# Altium project PVS332V0MAINBOARD.PRJPCB
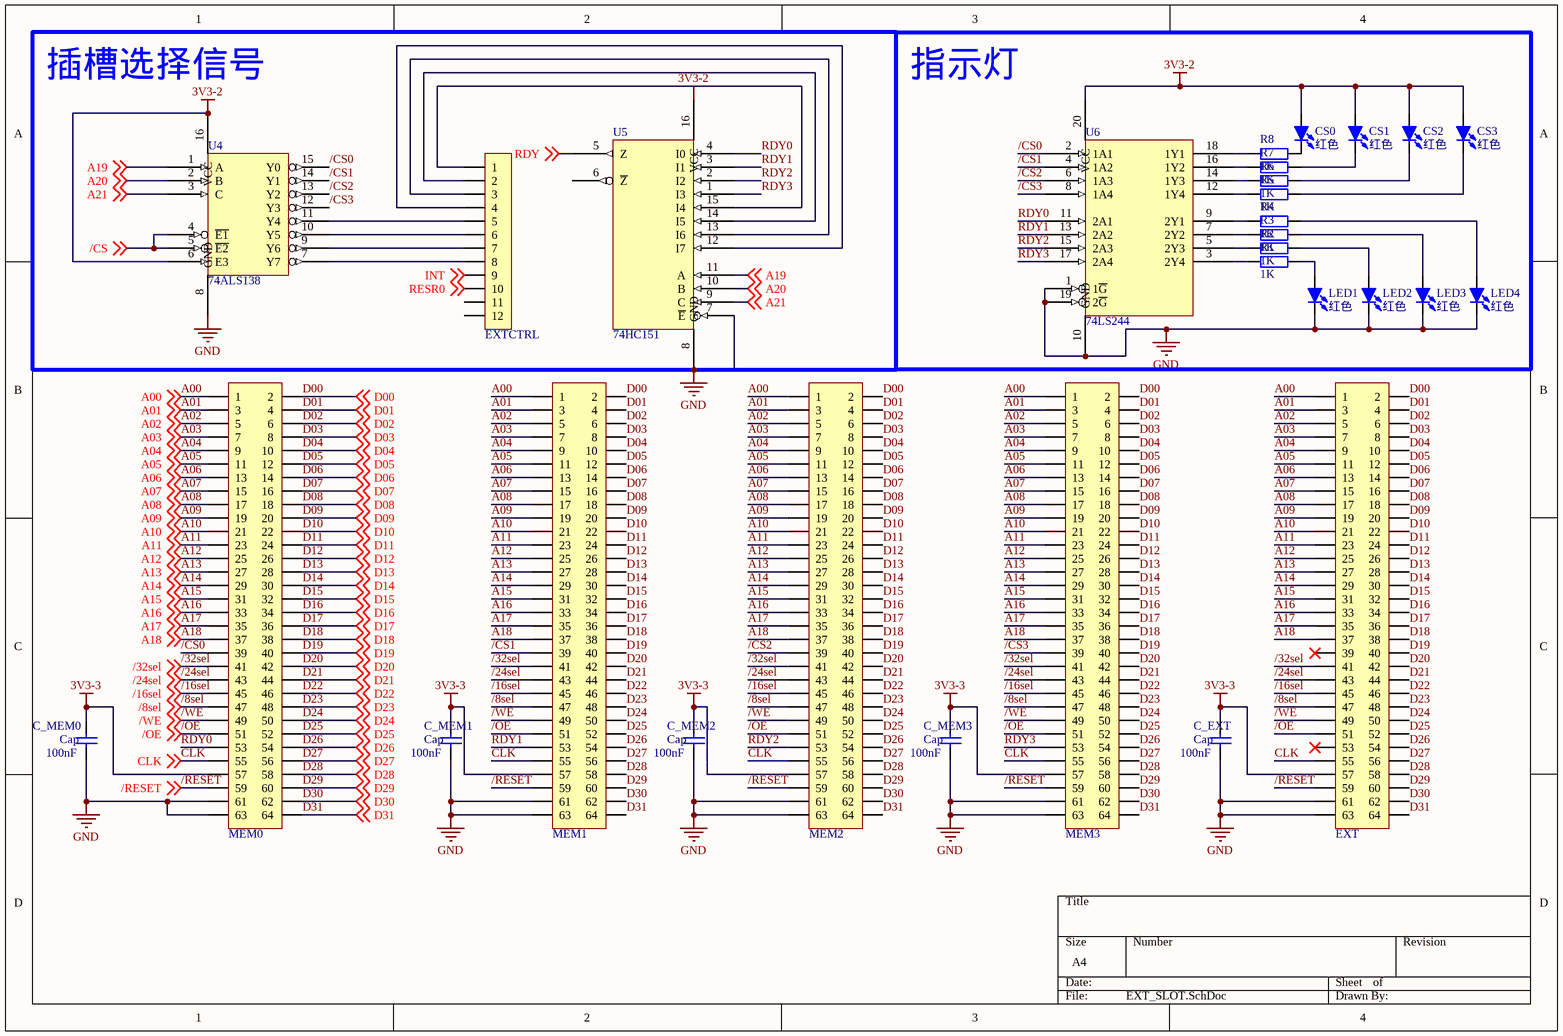
[diagram p0: EXT_SLOT.SchDoc]
3 sheets, 94 parts. Net scope: global (net labels, ports and power ports of the same name join across sheets).
Board file: PCB1.PcbDoc
Sheets:
  EXT_SLOT.SchDoc
  CPU&POWER.SchDoc
  SPI_IO.SchDoc

## Sheet EXT_SLOT.SchDoc
size A4

### Parts
C_EXT  Cap  value 100nF  [0805]
C_MEM0  Cap  value 100nF  [0805]
C_MEM1  Cap  value 100nF  [0805]
C_MEM2  Cap  value 100nF  [0805]
C_MEM3  Cap  value 100nF  [0805]
CS0  红色  [LED 5MM-B]
CS1  红色  [LED 5MM-B]
CS2  红色  [LED 5MM-B]
CS3  红色  [LED 5MM-B]
EXT  Header 2X32  [IDC2.54-V64D]  (value not drawn)
EXTCTRL  HDR-1X12  [SIP12]  (value not drawn)
LED1  红色  [LED 5MM-B]
LED2  红色  [LED 5MM-B]
LED3  红色  [LED 5MM-B]
LED4  红色  [LED 5MM-B]
MEM0  Header 2X32  [IDC2.54-V64D]  (value not drawn)
MEM1  Header 2X32  [IDC2.54-V64D]  (value not drawn)
MEM2  Header 2X32  [IDC2.54-V64D]  (value not drawn)
MEM3  Header 2X32  [IDC2.54-V64D]  (value not drawn)
R1  1K  [0805]
R2  1K  [0805]
R3  1K  [0805]
R4  1K  [0805]
R5  1K  [0805]
R6  1K  [0805]
R7  1K  [0805]
R8  1K  [0805]
U4  74ALS138  [SO-16]
U5  74HC151  [SO-16]
U6  74LS244  [SOJ-20]

### Blocks framed on the sheet
插槽选择信号: EXTCTRL U4 U5

### Nets
3V3-2: CS0.1(A) CS1.1(A) CS2.1(A) CS3.1(A) U4.6(E3) U4.16(VCC) U5.16(VCC) U6.20(VCC)  [also labelled VCC]  [project net 3V3-1]
3V3-3: C_EXT.2 C_MEM0.2 C_MEM1.2 C_MEM2.2 C_MEM3.2 EXT.57 MEM0.57 MEM1.57 MEM2.57 MEM3.57
GND: C_EXT.1 C_MEM0.1 C_MEM1.1 C_MEM2.1 C_MEM3.1 EXT.61 EXT.63 LED1.2(K) LED2.2(K) LED3.2(K) LED4.2(K) MEM0.61 MEM0.63 MEM1.61 MEM1.63 MEM2.61 MEM2.63 MEM3.61 MEM3.63 U4.8(GND) U5.7(~{E}) U5.8(GND) U6.1(1~{G}) U6.10(GND) U6.19(2~{G})
/8sel: EXT.47 MEM0.47 MEM1.47 MEM2.47 MEM3.47 ; off-sheet /8sel
/16sel: EXT.45 MEM0.45 MEM1.45 MEM2.45 MEM3.45 ; off-sheet /16sel
/24sel: EXT.43 MEM0.43 MEM1.43 MEM2.43 MEM3.43 ; off-sheet /24sel
/32sel: EXT.41 MEM0.41 MEM1.41 MEM2.41 MEM3.41 ; off-sheet /32sel
/CS: U4.4(~{E1}) U4.5(~{E2}) ; off-sheet /CS
/CS0: MEM0.39 U4.15(Y0) U6.2(1A1)
/CS1: MEM1.39 U4.14(Y1) U6.4(1A2)
/CS2: MEM2.39 U4.13(Y2) U6.6(1A3)
/CS3: MEM3.39 U4.12(Y3) U6.8(1A4)
/OE: EXT.51 MEM0.51 MEM1.51 MEM2.51 MEM3.51 ; off-sheet /OE
/RESET: EXT.59 MEM0.59 MEM1.59 MEM2.59 MEM3.59 ; off-sheet /RESET
/WE: EXT.49 MEM0.49 MEM1.49 MEM2.49 MEM3.49 ; off-sheet /WE
A00: EXT.1 MEM0.1 MEM1.1 MEM2.1 MEM3.1 ; off-sheet A00
A01: EXT.3 MEM0.3 MEM1.3 MEM2.3 MEM3.3 ; off-sheet A01
A02: EXT.5 MEM0.5 MEM1.5 MEM2.5 MEM3.5 ; off-sheet A02
A03: EXT.7 MEM0.7 MEM1.7 MEM2.7 MEM3.7 ; off-sheet A03
A04: EXT.9 MEM0.9 MEM1.9 MEM2.9 MEM3.9 ; off-sheet A04
A05: EXT.11 MEM0.11 MEM1.11 MEM2.11 MEM3.11 ; off-sheet A05
A06: EXT.13 MEM0.13 MEM1.13 MEM2.13 MEM3.13 ; off-sheet A06
A07: EXT.15 MEM0.15 MEM1.15 MEM2.15 MEM3.15 ; off-sheet A07
A08: EXT.17 MEM0.17 MEM1.17 MEM2.17 MEM3.17 ; off-sheet A08
A09: EXT.19 MEM0.19 MEM1.19 MEM2.19 MEM3.19 ; off-sheet A09
A10: EXT.21 MEM0.21 MEM1.21 MEM2.21 MEM3.21 ; off-sheet A10
A11: EXT.23 MEM0.23 MEM1.23 MEM2.23 MEM3.23 ; off-sheet A11
A12: EXT.25 MEM0.25 MEM1.25 MEM2.25 MEM3.25 ; off-sheet A12
A13: EXT.27 MEM0.27 MEM1.27 MEM2.27 MEM3.27 ; off-sheet A13
A14: EXT.29 MEM0.29 MEM1.29 MEM2.29 MEM3.29 ; off-sheet A14
A15: EXT.31 MEM0.31 MEM1.31 MEM2.31 MEM3.31 ; off-sheet A15
A16: EXT.33 MEM0.33 MEM1.33 MEM2.33 MEM3.33 ; off-sheet A16
A17: EXT.35 MEM0.35 MEM1.35 MEM2.35 MEM3.35 ; off-sheet A17
A18: EXT.37 MEM0.37 MEM1.37 MEM2.37 MEM3.37 ; off-sheet A18
A19: U4.1(A) U5.11(A) ; off-sheet A19
A20: U4.2(B) U5.10(B) ; off-sheet A20
A21: U4.3(C) U5.9(C) ; off-sheet A21
CLK: EXT.55 MEM0.55 MEM1.55 MEM2.55 MEM3.55 ; off-sheet CLK
D00: EXT.2 MEM0.2 MEM1.2 MEM2.2 MEM3.2 ; off-sheet D00
D01: EXT.4 MEM0.4 MEM1.4 MEM2.4 MEM3.4 ; off-sheet D01
D02: EXT.6 MEM0.6 MEM1.6 MEM2.6 MEM3.6 ; off-sheet D02
D03: EXT.8 MEM0.8 MEM1.8 MEM2.8 MEM3.8 ; off-sheet D03
D04: EXT.10 MEM0.10 MEM1.10 MEM2.10 MEM3.10 ; off-sheet D04
D05: EXT.12 MEM0.12 MEM1.12 MEM2.12 MEM3.12 ; off-sheet D05
D06: EXT.14 MEM0.14 MEM1.14 MEM2.14 MEM3.14 ; off-sheet D06
D07: EXT.16 MEM0.16 MEM1.16 MEM2.16 MEM3.16 ; off-sheet D07
D08: EXT.18 MEM0.18 MEM1.18 MEM2.18 MEM3.18 ; off-sheet D08
D09: EXT.20 MEM0.20 MEM1.20 MEM2.20 MEM3.20 ; off-sheet D09
D10: EXT.22 MEM0.22 MEM1.22 MEM2.22 MEM3.22 ; off-sheet D10
D11: EXT.24 MEM0.24 MEM1.24 MEM2.24 MEM3.24 ; off-sheet D11
D12: EXT.26 MEM0.26 MEM1.26 MEM2.26 MEM3.26 ; off-sheet D12
D13: EXT.28 MEM0.28 MEM1.28 MEM2.28 MEM3.28 ; off-sheet D13
D14: EXT.30 MEM0.30 MEM1.30 MEM2.30 MEM3.30 ; off-sheet D14
D15: EXT.32 MEM0.32 MEM1.32 MEM2.32 MEM3.32 ; off-sheet D15
D16: EXT.34 MEM0.34 MEM1.34 MEM2.34 MEM3.34 ; off-sheet D16
D17: EXT.36 MEM0.36 MEM1.36 MEM2.36 MEM3.36 ; off-sheet D17
D18: EXT.38 MEM0.38 MEM1.38 MEM2.38 MEM3.38 ; off-sheet D18
D19: EXT.40 MEM0.40 MEM1.40 MEM2.40 MEM3.40 ; off-sheet D19
D20: EXT.42 MEM0.42 MEM1.42 MEM2.42 MEM3.42 ; off-sheet D20
D21: EXT.44 MEM0.44 MEM1.44 MEM2.44 MEM3.44 ; off-sheet D21
D22: EXT.46 MEM0.46 MEM1.46 MEM2.46 MEM3.46 ; off-sheet D22
D23: EXT.48 MEM0.48 MEM1.48 MEM2.48 MEM3.48 ; off-sheet D23
D24: EXT.50 MEM0.50 MEM1.50 MEM2.50 MEM3.50 ; off-sheet D24
D25: EXT.52 MEM0.52 MEM1.52 MEM2.52 MEM3.52 ; off-sheet D25
D26: EXT.54 MEM0.54 MEM1.54 MEM2.54 MEM3.54 ; off-sheet D26
D27: EXT.56 MEM0.56 MEM1.56 MEM2.56 MEM3.56 ; off-sheet D27
D28: EXT.58 MEM0.58 MEM1.58 MEM2.58 MEM3.58 ; off-sheet D28
D29: EXT.60 MEM0.60 MEM1.60 MEM2.60 MEM3.60 ; off-sheet D29
D30: EXT.62 MEM0.62 MEM1.62 MEM2.62 MEM3.62 ; off-sheet D30
D31: EXT.64 MEM0.64 MEM1.64 MEM2.64 MEM3.64 ; off-sheet D31
INT: EXTCTRL.9 ; off-sheet INT
RDY: U5.5(Z) ; off-sheet RDY
RDY0: MEM0.53 U5.4(I0) U6.11(2A1)
RDY1: MEM1.53 U5.3(I1) U6.13(2A2)
RDY2: MEM2.53 U5.2(I2) U6.15(2A3)
RDY3: MEM3.53 U5.1(I3) U6.17(2A4)
RESR0: EXTCTRL.10 ; off-sheet RESR0
NetCS0_2: CS0.2(K) R8.2
NetCS1_2: CS1.2(K) R7.2
NetCS2_2: CS2.2(K) R6.2
NetCS3_2: CS3.2(K) R5.2
NetEXTCTRL_1: EXTCTRL.1 U5.15(I4)
NetEXTCTRL_2: EXTCTRL.2 U5.14(I5)
NetEXTCTRL_3: EXTCTRL.3 U5.13(I6)
NetEXTCTRL_4: EXTCTRL.4 U5.12(I7)
NetEXTCTRL_5: EXTCTRL.5 U4.11(Y4)
NetEXTCTRL_6: EXTCTRL.6 U4.10(Y5)
NetEXTCTRL_7: EXTCTRL.7 U4.9(Y6)
NetEXTCTRL_8: EXTCTRL.8 U4.7(Y7)
NetLED1_1: LED1.1(A) R1.2
NetLED2_1: LED2.1(A) R2.2
NetLED3_1: LED3.1(A) R3.2
NetLED4_1: LED4.1(A) R4.2
NetR1_1: R1.1 U6.3(2Y4)
NetR2_1: R2.1 U6.5(2Y3)
NetR3_1: R3.1 U6.7(2Y2)
NetR4_1: R4.1 U6.9(2Y1)
NetR5_1: R5.1 U6.12(1Y4)
NetR6_1: R6.1 U6.14(1Y3)
NetR7_1: R7.1 U6.16(1Y2)
NetR8_1: R8.1 U6.18(1Y1)

Not connected (* = marked no-connect by the designer): EXT 39* 53*; EXTCTRL 11 12; U5 6(~{Z})

### Notes on the sheet
- 指示灯

### Library data of the parts
C_EXT C_MEM0-C_MEM3 = Cap: Capacitor; Published: 8-Jun-2000; LatestRevisionDate: 17-Jul-2002; LatestRevisionNote: Re-released for DXP Platform.; PackageReference: RAD-0.3; Publisher: Altium Limited; PackageDescription: Radial Cap, Thru-Hole; 2 Leads; 0.3 in Pin Spacing
CS0-CS3 LED1-LED4 = LED-5MM: 5mm插件LED; 版权归属: 源创客; BOM名称: 5mm插件LED; 学习资源: www.ooocke.com
EXT MEM0-MEM3 = Header 32X2: 32*2P接插件; BOM名称: 20*2P接插件; 版权归属: 源创客; 学习资源: www.ooocke.com
EXTCTRL = Header 12: 12P接插件; 版权归属: 源创客; BOM名称: 12P接插件; 学习资源: www.ooocke.com
R1-R8 = R: 贴片电阻; 版权归属: 源创客; BOM名称: 贴片电阻; 学习资源: www.ooocke.com

## Sheet CPU&POWER.SchDoc
size A4
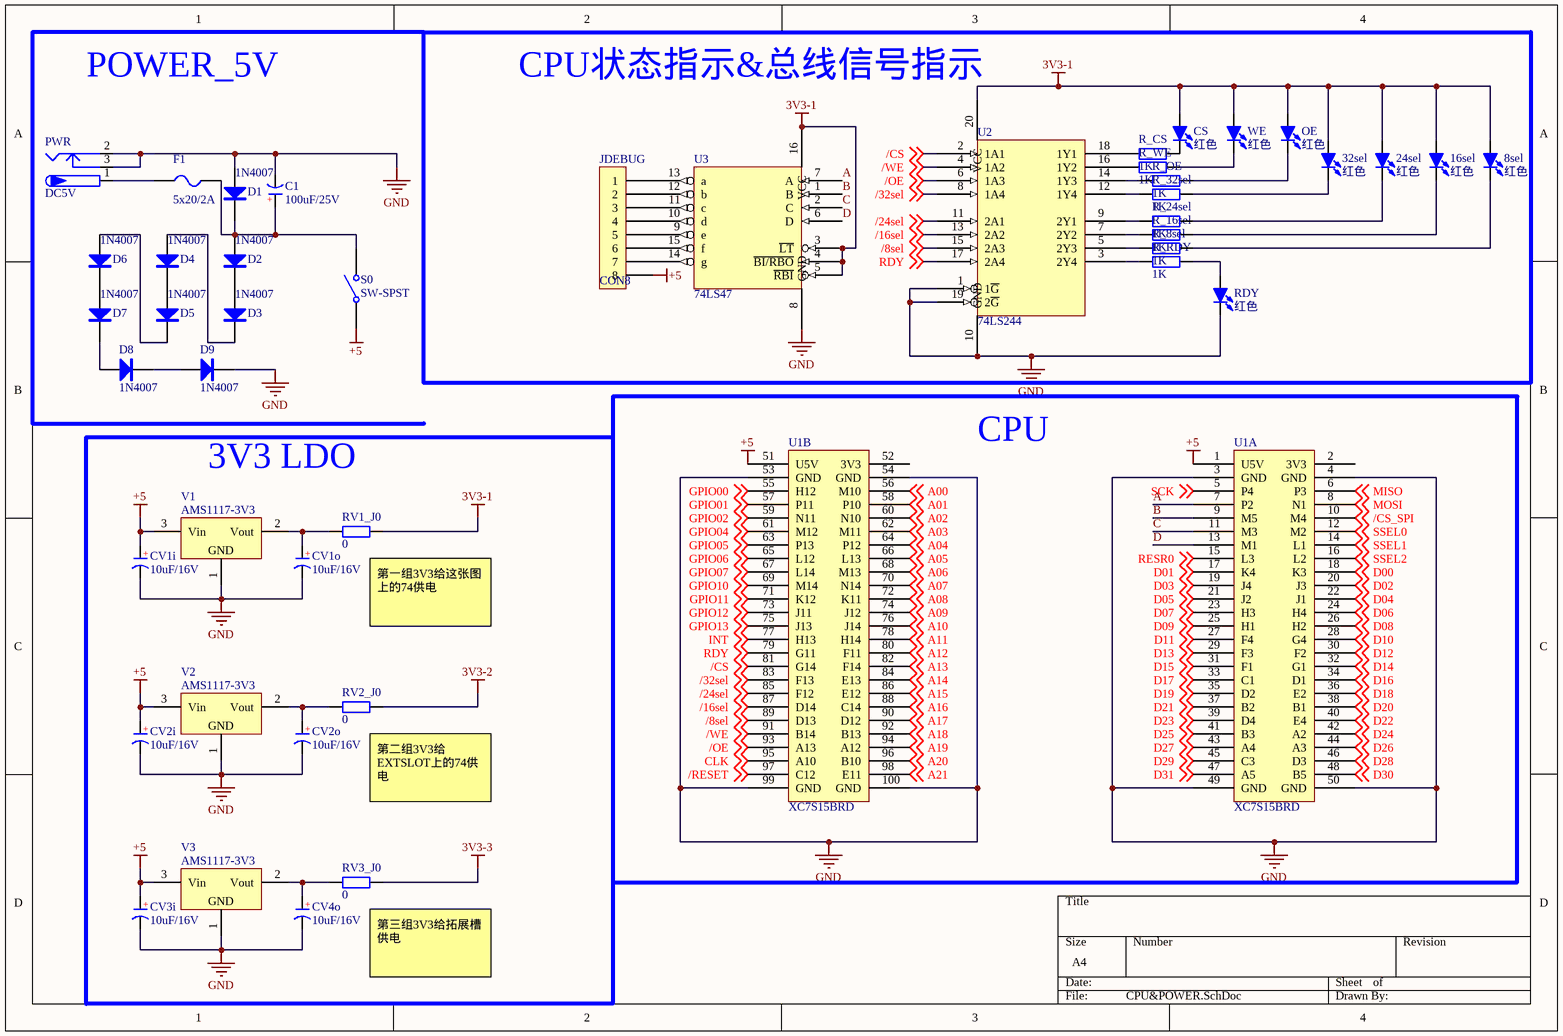
[diagram p1: CPU&POWER.SchDoc]

### Parts
8sel  红色  [LED 5MM-Y]
16sel  红色  [LED 5MM-YC]
24sel  红色  [LED 5MM-YC]
32sel  红色  [LED 5MM-YC]
C1  100uF/25V  [CAP3.0]
CS  红色  [LED 5MM-B]
CV1i  10uF/16V  [CAP2.54M]
CV1o  10uF/16V  [CAP2.54M]
CV2i  10uF/16V  [CAP2.54M]
CV2o  10uF/16V  [CAP2.54M]
CV3i  10uF/16V  [CAP2.54M]
CV4o  10uF/16V  [CAP2.54M]
D1  1N4007  [DO-41]
D2  1N4007  [DO-41]
D3  1N4007  [DO-41]
D4  1N4007  [DO-41]
D5  1N4007  [DO-41]
D6  1N4007  [DO-41]
D7  1N4007  [DO-41]
D8  1N4007  [DO-41]
D9  1N4007  [DO-41]
F1  5x20/2A  [FU 5x20]
JDEBUG  CON8  [SIP8]
OE  红色  [LED 5MM-B]
PWR  DC5V  [DC-005]
R_8sel  1K  [0805]
R_16sel  1K  [0805]
R_24sel  1K  [0805]
R_32sel  1K  [0805]
R_CS  1K  [0805]
R_OE  1K  [0805]
R_RDY  1K  [0805]
R_WE  1K  [0805]
RDY  红色  [LED 5MM-B]
RV1_J0  0  [0805]
RV2_J0  0  [0805]
RV3_J0  0  [0805]
S0  SW-SPST  [DIP6]
U1  XC7S15BRD  [XC7S15BRD]  (parts A,B of 2)
U2  74LS244  [SOJ-20]
U3  74LS47  [DIP-16]
V1  AMS1117-3V3  [SOT-223_手工焊接]
V2  AMS1117-3V3  [SOT-223_手工焊接]
V3  AMS1117-3V3  [SOT-223_手工焊接]
WE  红色  [LED 5MM-B]

### Blocks framed on the sheet
CPU状态指示&总线信号指示: 8sel 16sel 24sel 32sel CS JDEBUG OE R_8sel R_16sel R_24sel R_32sel R_CS R_OE R_RDY R_WE RDY U2 U3 WE
CPU: U1
3V3 LDO: CV1i CV1o CV2i CV2o CV3i CV4o RV1_J0 RV2_J0 RV3_J0 V1-V3

### Nets
3V3-1: 8sel.1(A) 16sel.1(A) 24sel.1(A) 32sel.1(A) CS.1(A) OE.1(A) RV1_J0.2 RV2_J0.2 U2.20(VCC) U3.3(~{LT}) U3.4(~{BI/RBO}) U3.5(~{RBI}) U3.16(VCC) WE.1(A)  [also labelled 3V3-2, VCC]
3V3-3: RV3_J0.2
+5: CV1i.1(A) CV2i.1(A) CV3i.1(A) JDEBUG.8 S0.1(COMMON) U1.1(U5V) U1.51(U5V) V1.3(Vin) V2.3(Vin) V3.3(Vin)
GND: C1.2(K) CV1i.2(K) CV1o.2(K) CV2i.2(K) CV2o.2(K) CV3i.2(K) CV4o.2(K) D1.1(A) D9.2(K) PWR.2 PWR.3 RDY.2(K) U1.3(GND) U1.4(GND) U1.49(GND) U1.50(GND) U1.53(GND) U1.54(GND) U1.99(GND) U1.100(GND) U2.1(1~{G}) U2.10(GND) U2.19(2~{G}) U3.8(GND) V1.1(GND) V2.1(GND) V3.1(GND)
/8sel: U1.89(D13) U2.15(2A3) ; off-sheet /8sel
/16sel: U1.87(D14) U2.13(2A2) ; off-sheet /16sel
/24sel: U1.85(F12) U2.11(2A1) ; off-sheet /24sel
/32sel: U1.83(F13) U2.8(1A4) ; off-sheet /32sel
/CS: U1.81(G14) U2.2(1A1) ; off-sheet /CS
/CS_SPI: U1.10(M4) ; off-sheet /CS_SPI
/OE: U1.93(A13) U2.6(1A3) ; off-sheet /OE
/RESET: U1.97(C12) ; off-sheet /RESET
/WE: U1.91(B14) U2.4(1A2) ; off-sheet /WE
A: U1.7(P2) U3.7(A)
A00: U1.56(M10) ; off-sheet A00
A01: U1.58(P10) ; off-sheet A01
A02: U1.60(N10) ; off-sheet A02
A03: U1.62(M11) ; off-sheet A03
A04: U1.64(P12) ; off-sheet A04
A05: U1.66(L13) ; off-sheet A05
A06: U1.68(M13) ; off-sheet A06
A07: U1.70(N14) ; off-sheet A07
A08: U1.72(K11) ; off-sheet A08
A09: U1.74(J12) ; off-sheet A09
A10: U1.76(J14) ; off-sheet A10
A11: U1.78(H14) ; off-sheet A11
A12: U1.80(F11) ; off-sheet A12
A13: U1.82(F14) ; off-sheet A13
A14: U1.84(E13) ; off-sheet A14
A15: U1.86(E12) ; off-sheet A15
A16: U1.88(C14) ; off-sheet A16
A17: U1.90(D12) ; off-sheet A17
A18: U1.92(B13) ; off-sheet A18
A19: U1.94(A12) ; off-sheet A19
A20: U1.96(B10) ; off-sheet A20
A21: U1.98(E11) ; off-sheet A21
B: U1.9(M5) U3.1(B)
C: U1.11(M3) U3.2(C)
CLK: U1.95(A10) ; off-sheet CLK
D: U1.13(M1) U3.6(D)
D00: U1.18(K3) ; off-sheet D00
D01: U1.17(K4) ; off-sheet D01
D02: U1.20(J3) ; off-sheet D02
D03: U1.19(J4) ; off-sheet D03
D04: U1.22(J1) ; off-sheet D04
D05: U1.21(J2) ; off-sheet D05
D06: U1.24(H4) ; off-sheet D06
D07: U1.23(H3) ; off-sheet D07
D08: U1.26(H2) ; off-sheet D08
D09: U1.25(H1) ; off-sheet D09
D10: U1.28(G4) ; off-sheet D10
D11: U1.27(F4) ; off-sheet D11
D12: U1.30(F2) ; off-sheet D12
D13: U1.29(F3) ; off-sheet D13
D14: U1.32(G1) ; off-sheet D14
D15: U1.31(F1) ; off-sheet D15
D16: U1.34(D1) ; off-sheet D16
D17: U1.33(C1) ; off-sheet D17
D18: U1.36(E2) ; off-sheet D18
D19: U1.35(D2) ; off-sheet D19
D20: U1.38(B1) ; off-sheet D20
D21: U1.37(B2) ; off-sheet D21
D22: U1.40(E4) ; off-sheet D22
D23: U1.39(D4) ; off-sheet D23
D24: U1.42(A2) ; off-sheet D24
D25: U1.41(B3) ; off-sheet D25
D26: U1.44(A3) ; off-sheet D26
D27: U1.43(A4) ; off-sheet D27
D28: U1.46(D3) ; off-sheet D28
D29: U1.45(C3) ; off-sheet D29
D30: U1.48(B5) ; off-sheet D30
D31: U1.47(A5) ; off-sheet D31
GPIO00: U1.55(H12) ; off-sheet GPIO00
GPIO01: U1.57(P11) ; off-sheet GPIO01
GPIO02: U1.59(N11) ; off-sheet GPIO02
GPIO04: U1.61(M12) ; off-sheet GPIO04
GPIO05: U1.63(P13) ; off-sheet GPIO05
GPIO06: U1.65(L12) ; off-sheet GPIO06
GPIO07: U1.67(L14) ; off-sheet GPIO07
GPIO10: U1.69(M14) ; off-sheet GPIO10
GPIO11: U1.71(K12) ; off-sheet GPIO11
GPIO12: U1.73(J11) ; off-sheet GPIO12
GPIO13: U1.75(J13) ; off-sheet GPIO13
INT: U1.77(H13) ; off-sheet INT
MISO: U1.6(P3) ; off-sheet MISO
MOSI: U1.8(N1) ; off-sheet MOSI
RDY: U1.79(G11) U2.17(2A4) ; off-sheet RDY
RESR0: U1.15(L3) ; off-sheet RESR0
SCK: U1.5(P4) ; off-sheet SCK
SSEL0: U1.12(M2) ; off-sheet SSEL0
SSEL1: U1.14(L1) ; off-sheet SSEL1
SSEL2: U1.16(L2) ; off-sheet SSEL2
Net8sel_2: 8sel.2(K) R_8sel.2
Net16sel_2: 16sel.2(K) R_16sel.2
Net24sel_2: 24sel.2(K) R_24sel.2
Net32sel_2: 32sel.2(K) R_32sel.2
NetC1_1: C1.1(A) D1.2(K) D2.1(A) F1.1 S0.2(NO)
NetCS_2: CS.2(K) R_CS.2
NetCV1o_1: CV1o.1(A) RV1_J0.1 V1.2(Vout)
NetCV2o_1: CV2o.1(A) RV2_J0.1 V2.2(Vout)
NetCV4o_1: CV4o.1(A) RV3_J0.1 V3.2(Vout)
NetD2_2: D2.2(K) D3.1(A)
NetD3_2: D3.2(K) D4.1(A)
NetD4_2: D4.2(K) D5.1(A)
NetD5_2: D5.2(K) D6.1(A)
NetD6_2: D6.2(K) D7.1(A)
NetD7_2: D7.2(K) D8.1(A)
NetD8_2: D8.2(K) D9.1(A)
NetF1_2: F1.2 PWR.1
NetJDEBUG_1: JDEBUG.1 U3.13(a)
NetJDEBUG_2: JDEBUG.2 U3.12(b)
NetJDEBUG_3: JDEBUG.3 U3.11(c)
NetJDEBUG_4: JDEBUG.4 U3.10(d)
NetJDEBUG_5: JDEBUG.5 U3.9(e)
NetJDEBUG_6: JDEBUG.6 U3.15(f)
NetJDEBUG_7: JDEBUG.7 U3.14(g)
NetOE_2: OE.2(K) R_OE.2
NetR_8sel_1: R_8sel.1 U2.5(2Y3)
NetR_16sel_1: R_16sel.1 U2.7(2Y2)
NetR_24sel_1: R_24sel.1 U2.9(2Y1)
NetR_32sel_1: R_32sel.1 U2.12(1Y4)
NetR_CS_1: R_CS.1 U2.18(1Y1)
NetR_OE_1: R_OE.1 U2.14(1Y3)
NetR_RDY_1: R_RDY.1 U2.3(2Y4)
NetR_RDY_2: R_RDY.2 RDY.1(A)
NetR_WE_1: R_WE.1 U2.16(1Y2)
NetR_WE_2: R_WE.2 WE.2(K)

Not connected (* = marked no-connect by the designer): U1 2(3V3) 52(3V3)

### Notes on the sheet
- POWER_5V
- (near RV1_J0) 第一组3V3给这张图上的74供电
- (near RV2_J0) 第二组3V3给EXTSLOT上的74供电
- (near RV3_J0) 第三组3V3给拓展槽供电
- (in symbol C-CAP) +

### Library data of the parts
8sel 16sel 24sel 32sel CS OE RDY WE = LED-5MM: 5mm插件LED; 版权归属: 源创客; BOM名称: 5mm插件LED; 学习资源: www.ooocke.com
C1 CV1i CV1o CV2i CV2o CV3i CV4o = C-CAP: 直插电解电容; 版权归属: 源创客; BOM名称: 直插电解电容; 学习资源: www.ooocke.com
D1-D9 = 1N4007: 整流二极管; 版权归属: 源创客; BOM名称: 整流二极管; 学习资源: www.ooocke.com
F1 = FU DIP: 直插保险丝; 版权归属: 源创客; BOM名称: 直插保险丝; 学习资源: www.ooocke.com
JDEBUG = CON8: Connector
PWR = P-DC: 低压电源接口; BOM名称: DC电源接口; 版权归属: 源创客; 学习资源: www.ooocke.com
R_8sel R_16sel R_24sel R_32sel R_CS R_OE R_RDY R_WE RV1_J0 RV2_J0 RV3_J0 = R: 贴片电阻; 版权归属: 源创客; BOM名称: 贴片电阻; 学习资源: www.ooocke.com
S0 = SW-SPST: Single-Pole, Single-Throw Switch; pin to pad: 2>6; Published: 24-Mar-1999; LatestRevisionDate: 17-Jul-2002; LatestRevisionNote: Re-released for DXP Platform.; PackageReference: SPST-2; Publisher: Altium Limited; PackageDescription: Switch; 2 Leads
V1-V3 = AMS1117: 三端稳压芯片; BOM名称: 稳压芯片; 版权归属: 源创客; 学习资源: www.ooocke.com

## Sheet SPI_IO.SchDoc
size A4
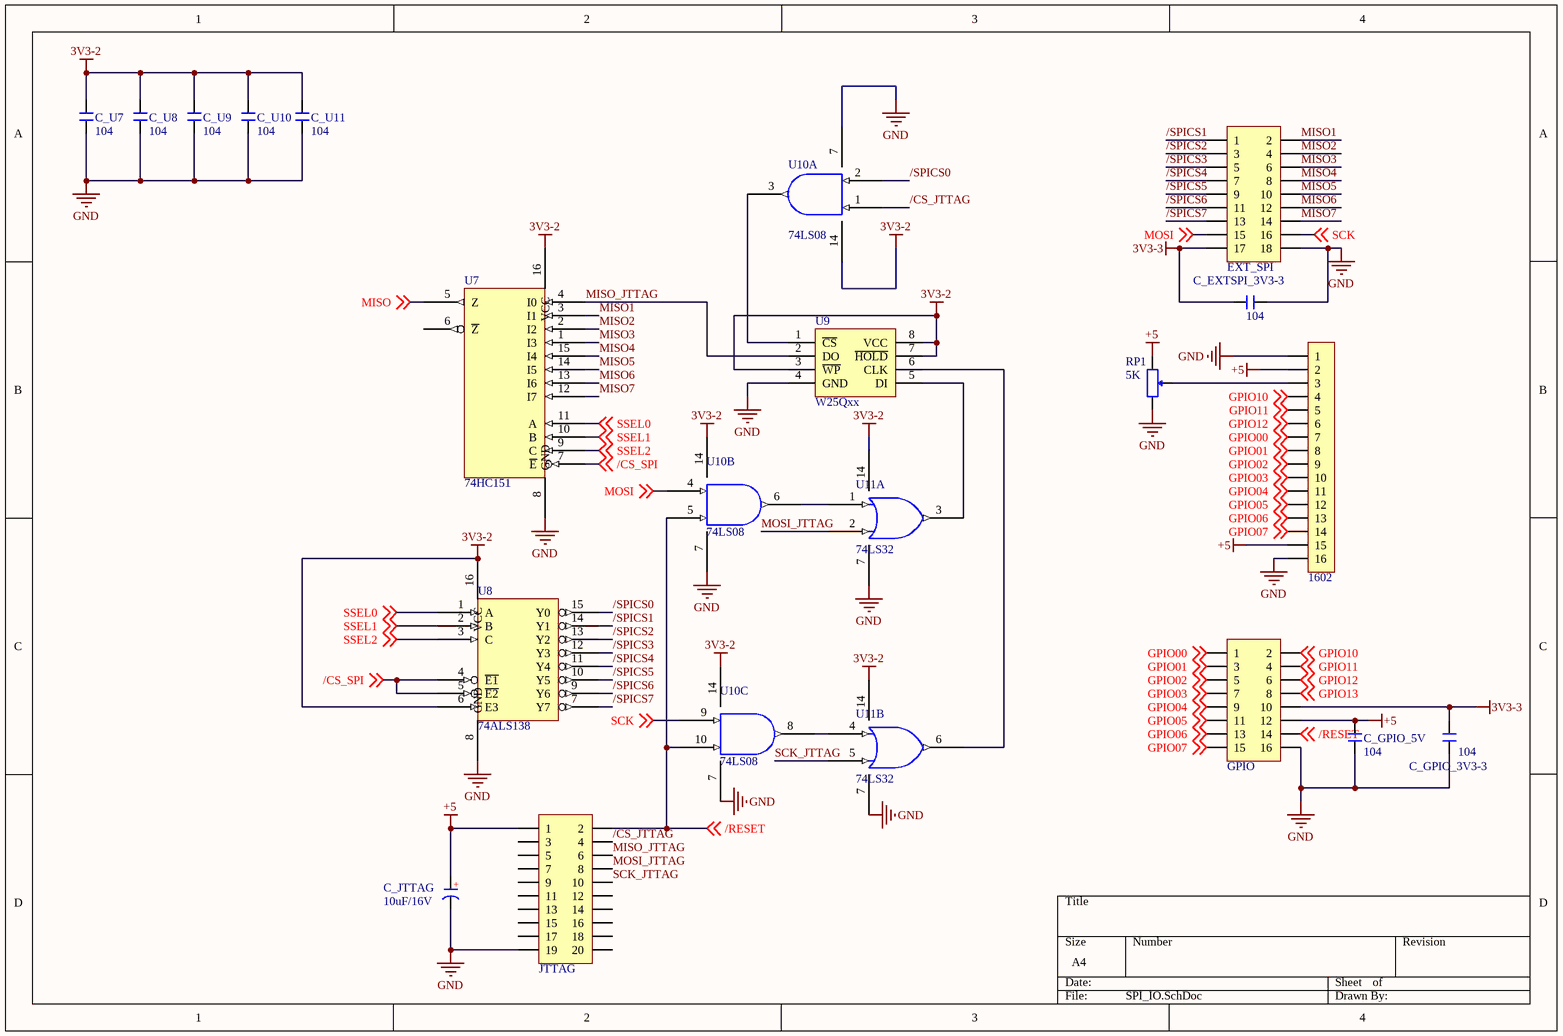
[diagram p2: SPI_IO.SchDoc]

### Parts
1602  HDR-1X16  [SIP16]  (value not drawn)
C_EXTSPI_3V3-3  104  [0805]
C_GPIO_3V3-3  104  [0805]
C_GPIO_5V  104  [0805]
C_JTTAG  10uF/16V  [RB.1/.2]
C_U7  104  [0805]
C_U8  104  [0805]
C_U9  104  [0805]
C_U10  104  [0805]
C_U11  104  [0805]
EXT_SPI  Header 9X2  [HDR2X9]  (value not drawn)
GPIO  Header 8X2  [HDR2X8]  (value not drawn)
JTTAG  Header 2X10  [IDC2.54-V20D]  (value not drawn)
RP1  5K  [3303W]
U7  74HC151  [SO-16]
U8  74ALS138  [SO-16]
U9  W25Qxx  [SOIC-8]
U10  74LS08  [SO-14]  (parts A,B,C of 4)
U11  74LS32  [SO-14]  (parts A,B of 4)

### Nets
3V3-2: C_U7.2 C_U8.2 C_U9.2 C_U10.2 C_U11.2 U7.16(VCC) U8.6(E3) U8.16(VCC) U9.3(~{WP}) U9.7(~{HOLD}) U9.8(VCC) U10.14(VCC) U11.14(VCC)  [also labelled VCC]  [project net 3V3-1]
3V3-3: C_EXTSPI_3V3-3.1 C_GPIO_3V3-3.2 EXT_SPI.17 GPIO.10
+5: 1602.2 1602.15 C_GPIO_5V.2 C_JTTAG.1(A) GPIO.12 JTTAG.1 RP1.1
GND: 1602.1 1602.16 C_EXTSPI_3V3-3.2 C_GPIO_3V3-3.1 C_GPIO_5V.1 C_JTTAG.2(K) C_U7.1 C_U8.1 C_U9.1 C_U10.1 C_U11.1 EXT_SPI.18 GPIO.16 JTTAG.19 RP1.3 U7.8(GND) U8.8(GND) U9.4(GND) U10.7(GND) U11.7(GND)
/CS_JTTAG: JTTAG.4 U10.1
/CS_SPI: U7.7(~{E}) U8.4(~{E1}) U8.5(~{E2}) ; off-sheet /CS_SPI
/RESET: GPIO.14 JTTAG.2 U10.5 U10.10 ; off-sheet /RESET
/SPICS0: U8.15(Y0) U10.2
/SPICS1: EXT_SPI.1 U8.14(Y1)
/SPICS2: EXT_SPI.3 U8.13(Y2)
/SPICS3: EXT_SPI.5 U8.12(Y3)
/SPICS4: EXT_SPI.7 U8.11(Y4)
/SPICS5: EXT_SPI.9 U8.10(Y5)
/SPICS6: EXT_SPI.11 U8.9(Y6)
/SPICS7: EXT_SPI.13 U8.7(Y7)
GPIO00: 1602.7 GPIO.1 ; off-sheet GPIO00
GPIO01: 1602.8 GPIO.3 ; off-sheet GPIO01
GPIO02: 1602.9 GPIO.5 ; off-sheet GPIO02
GPIO03: 1602.10 GPIO.7 ; off-sheet GPIO03
GPIO04: 1602.11 GPIO.9 ; off-sheet GPIO04
GPIO05: 1602.12 GPIO.11 ; off-sheet GPIO05
GPIO06: 1602.13 GPIO.13 ; off-sheet GPIO06
GPIO07: 1602.14 GPIO.15 ; off-sheet GPIO07
GPIO10: 1602.4 GPIO.2 ; off-sheet GPIO10
GPIO11: 1602.5 GPIO.4 ; off-sheet GPIO11
GPIO12: 1602.6 GPIO.6 ; off-sheet GPIO12
GPIO13: GPIO.8 ; off-sheet GPIO13
MISO: U7.5(Z) ; off-sheet MISO
MISO1: EXT_SPI.2 U7.3(I1)
MISO2: EXT_SPI.4 U7.2(I2)
MISO3: EXT_SPI.6 U7.1(I3)
MISO4: EXT_SPI.8 U7.15(I4)
MISO5: EXT_SPI.10 U7.14(I5)
MISO6: EXT_SPI.12 U7.13(I6)
MISO7: EXT_SPI.14 U7.12(I7)
MISO_JTTAG: JTTAG.6 U7.4(I0) U9.2(DO)
MOSI: EXT_SPI.15 U10.4 ; off-sheet MOSI
MOSI_JTTAG: JTTAG.8 U11.2
SCK: EXT_SPI.16 U10.9 ; off-sheet SCK
SCK_JTTAG: JTTAG.10 U11.5
SSEL0: U7.11(A) U8.1(A) ; off-sheet SSEL0
SSEL1: U7.10(B) U8.2(B) ; off-sheet SSEL1
SSEL2: U7.9(C) U8.3(C) ; off-sheet SSEL2
Net1602_3: 1602.3 RP1.2
NetU9_1: U9.1(~{CS}) U10.3
NetU9_5: U9.5(DI) U11.3
NetU9_6: U9.6(CLK) U11.6
NetU10_6: U10.6 U11.1
NetU10_8: U10.8 U11.4

Not connected (* = marked no-connect by the designer): JTTAG 3 5 7 9 11 12 13 14 15 16 17 18 20; U7 6(~{Z})

### Notes on the sheet
- (in symbol C-CAP) +

### Library data of the parts
1602 = Header 16: 16P接插件; 版权归属: 源创客; BOM名称: 16P接插件; 学习资源: www.ooocke.com
C_EXTSPI_3V3-3 C_GPIO_3V3-3 C_GPIO_5V C_U7-C_U11 = C: 无极性贴片电容; 版权归属: 源创客; BOM名称: 无极性贴片电容; 学习资源: www.ooocke.com
C_JTTAG = C-CAP: 直插电解电容; 版权归属: 源创客; BOM名称: 直插电解电容; 学习资源: www.ooocke.com
EXT_SPI = Header 9X2: 9*2P接插件; 版权归属: 源创客; BOM名称: 9*2P接插件; 学习资源: www.ooocke.com
GPIO = Header 8X2: 8*2P接插件; 版权归属: 源创客; BOM名称: 8*2P接插件; 学习资源: www.ooocke.com
JTTAG = Header 10X2: 10*2P接插件; 版权归属: 源创客; BOM名称: 10*2P接插件; 学习资源: www.ooocke.com
RP1 = RP-SMD: 贴片电位器; 版权归属: 源创客; BOM名称: 贴片电位器; 学习资源: www.ooocke.com
U9 = W25Qxx: 外置Flash; 版权归属: 源创客; BOM名称: 外置Flash; 学习资源: www.ooocke.com

## Nets that join several sheets
3V3-1: EXT_SLOT (8 pins), CPU&POWER (14 pins), SPI_IO (13 pins)
3V3-3: EXT_SLOT (10 pins), CPU&POWER (RV3_J0.2), SPI_IO (C_EXTSPI_3V3-3.1 C_GPIO_3V3-3.2 EXT_SPI.17 GPIO.10)
+5: CPU&POWER (10 pins), SPI_IO (7 pins)
GND: EXT_SLOT (25 pins), CPU&POWER (27 pins), SPI_IO (20 pins)
/8sel: EXT_SLOT (5 pins), CPU&POWER (U1.89 U2.15)
/16sel: EXT_SLOT (5 pins), CPU&POWER (U1.87 U2.13)
/24sel: EXT_SLOT (5 pins), CPU&POWER (U1.85 U2.11)
/32sel: EXT_SLOT (5 pins), CPU&POWER (U1.83 U2.8)
/CS: EXT_SLOT (U4.4 U4.5), CPU&POWER (U1.81 U2.2)
/CS_SPI: CPU&POWER (U1.10), SPI_IO (U7.7 U8.4 U8.5)
/OE: EXT_SLOT (5 pins), CPU&POWER (U1.93 U2.6)
/RESET: EXT_SLOT (5 pins), CPU&POWER (U1.97), SPI_IO (GPIO.14 JTTAG.2 U10.5 U10.10)
/WE: EXT_SLOT (5 pins), CPU&POWER (U1.91 U2.4)
A00: EXT_SLOT (5 pins), CPU&POWER (U1.56)
A01: EXT_SLOT (5 pins), CPU&POWER (U1.58)
A02: EXT_SLOT (5 pins), CPU&POWER (U1.60)
A03: EXT_SLOT (5 pins), CPU&POWER (U1.62)
A04: EXT_SLOT (5 pins), CPU&POWER (U1.64)
A05: EXT_SLOT (5 pins), CPU&POWER (U1.66)
A06: EXT_SLOT (5 pins), CPU&POWER (U1.68)
A07: EXT_SLOT (5 pins), CPU&POWER (U1.70)
A08: EXT_SLOT (5 pins), CPU&POWER (U1.72)
A09: EXT_SLOT (5 pins), CPU&POWER (U1.74)
A10: EXT_SLOT (5 pins), CPU&POWER (U1.76)
A11: EXT_SLOT (5 pins), CPU&POWER (U1.78)
A12: EXT_SLOT (5 pins), CPU&POWER (U1.80)
A13: EXT_SLOT (5 pins), CPU&POWER (U1.82)
A14: EXT_SLOT (5 pins), CPU&POWER (U1.84)
A15: EXT_SLOT (5 pins), CPU&POWER (U1.86)
A16: EXT_SLOT (5 pins), CPU&POWER (U1.88)
A17: EXT_SLOT (5 pins), CPU&POWER (U1.90)
A18: EXT_SLOT (5 pins), CPU&POWER (U1.92)
A19: EXT_SLOT (U4.1 U5.11), CPU&POWER (U1.94)
A20: EXT_SLOT (U4.2 U5.10), CPU&POWER (U1.96)
A21: EXT_SLOT (U4.3 U5.9), CPU&POWER (U1.98)
CLK: EXT_SLOT (5 pins), CPU&POWER (U1.95)
D00: EXT_SLOT (5 pins), CPU&POWER (U1.18)
D01: EXT_SLOT (5 pins), CPU&POWER (U1.17)
D02: EXT_SLOT (5 pins), CPU&POWER (U1.20)
D03: EXT_SLOT (5 pins), CPU&POWER (U1.19)
D04: EXT_SLOT (5 pins), CPU&POWER (U1.22)
D05: EXT_SLOT (5 pins), CPU&POWER (U1.21)
D06: EXT_SLOT (5 pins), CPU&POWER (U1.24)
D07: EXT_SLOT (5 pins), CPU&POWER (U1.23)
D08: EXT_SLOT (5 pins), CPU&POWER (U1.26)
D09: EXT_SLOT (5 pins), CPU&POWER (U1.25)
D10: EXT_SLOT (5 pins), CPU&POWER (U1.28)
D11: EXT_SLOT (5 pins), CPU&POWER (U1.27)
D12: EXT_SLOT (5 pins), CPU&POWER (U1.30)
D13: EXT_SLOT (5 pins), CPU&POWER (U1.29)
D14: EXT_SLOT (5 pins), CPU&POWER (U1.32)
D15: EXT_SLOT (5 pins), CPU&POWER (U1.31)
D16: EXT_SLOT (5 pins), CPU&POWER (U1.34)
D17: EXT_SLOT (5 pins), CPU&POWER (U1.33)
D18: EXT_SLOT (5 pins), CPU&POWER (U1.36)
D19: EXT_SLOT (5 pins), CPU&POWER (U1.35)
D20: EXT_SLOT (5 pins), CPU&POWER (U1.38)
D21: EXT_SLOT (5 pins), CPU&POWER (U1.37)
D22: EXT_SLOT (5 pins), CPU&POWER (U1.40)
D23: EXT_SLOT (5 pins), CPU&POWER (U1.39)
D24: EXT_SLOT (5 pins), CPU&POWER (U1.42)
D25: EXT_SLOT (5 pins), CPU&POWER (U1.41)
D26: EXT_SLOT (5 pins), CPU&POWER (U1.44)
D27: EXT_SLOT (5 pins), CPU&POWER (U1.43)
D28: EXT_SLOT (5 pins), CPU&POWER (U1.46)
D29: EXT_SLOT (5 pins), CPU&POWER (U1.45)
D30: EXT_SLOT (5 pins), CPU&POWER (U1.48)
D31: EXT_SLOT (5 pins), CPU&POWER (U1.47)
GPIO00: CPU&POWER (U1.55), SPI_IO (1602.7 GPIO.1)
GPIO01: CPU&POWER (U1.57), SPI_IO (1602.8 GPIO.3)
GPIO02: CPU&POWER (U1.59), SPI_IO (1602.9 GPIO.5)
GPIO04: CPU&POWER (U1.61), SPI_IO (1602.11 GPIO.9)
GPIO05: CPU&POWER (U1.63), SPI_IO (1602.12 GPIO.11)
GPIO06: CPU&POWER (U1.65), SPI_IO (1602.13 GPIO.13)
GPIO07: CPU&POWER (U1.67), SPI_IO (1602.14 GPIO.15)
GPIO10: CPU&POWER (U1.69), SPI_IO (1602.4 GPIO.2)
GPIO11: CPU&POWER (U1.71), SPI_IO (1602.5 GPIO.4)
GPIO12: CPU&POWER (U1.73), SPI_IO (1602.6 GPIO.6)
GPIO13: CPU&POWER (U1.75), SPI_IO (GPIO.8)
INT: EXT_SLOT (EXTCTRL.9), CPU&POWER (U1.77)
MISO: CPU&POWER (U1.6), SPI_IO (U7.5)
MOSI: CPU&POWER (U1.8), SPI_IO (EXT_SPI.15 U10.4)
RDY: EXT_SLOT (U5.5), CPU&POWER (U1.79 U2.17)
RESR0: EXT_SLOT (EXTCTRL.10), CPU&POWER (U1.15)
SCK: CPU&POWER (U1.5), SPI_IO (EXT_SPI.16 U10.9)
SSEL0: CPU&POWER (U1.12), SPI_IO (U7.11 U8.1)
SSEL1: CPU&POWER (U1.14), SPI_IO (U7.10 U8.2)
SSEL2: CPU&POWER (U1.16), SPI_IO (U7.9 U8.3)